# EAGLE schematic Schematic_NixieClock (EAGLE 9.7.0)
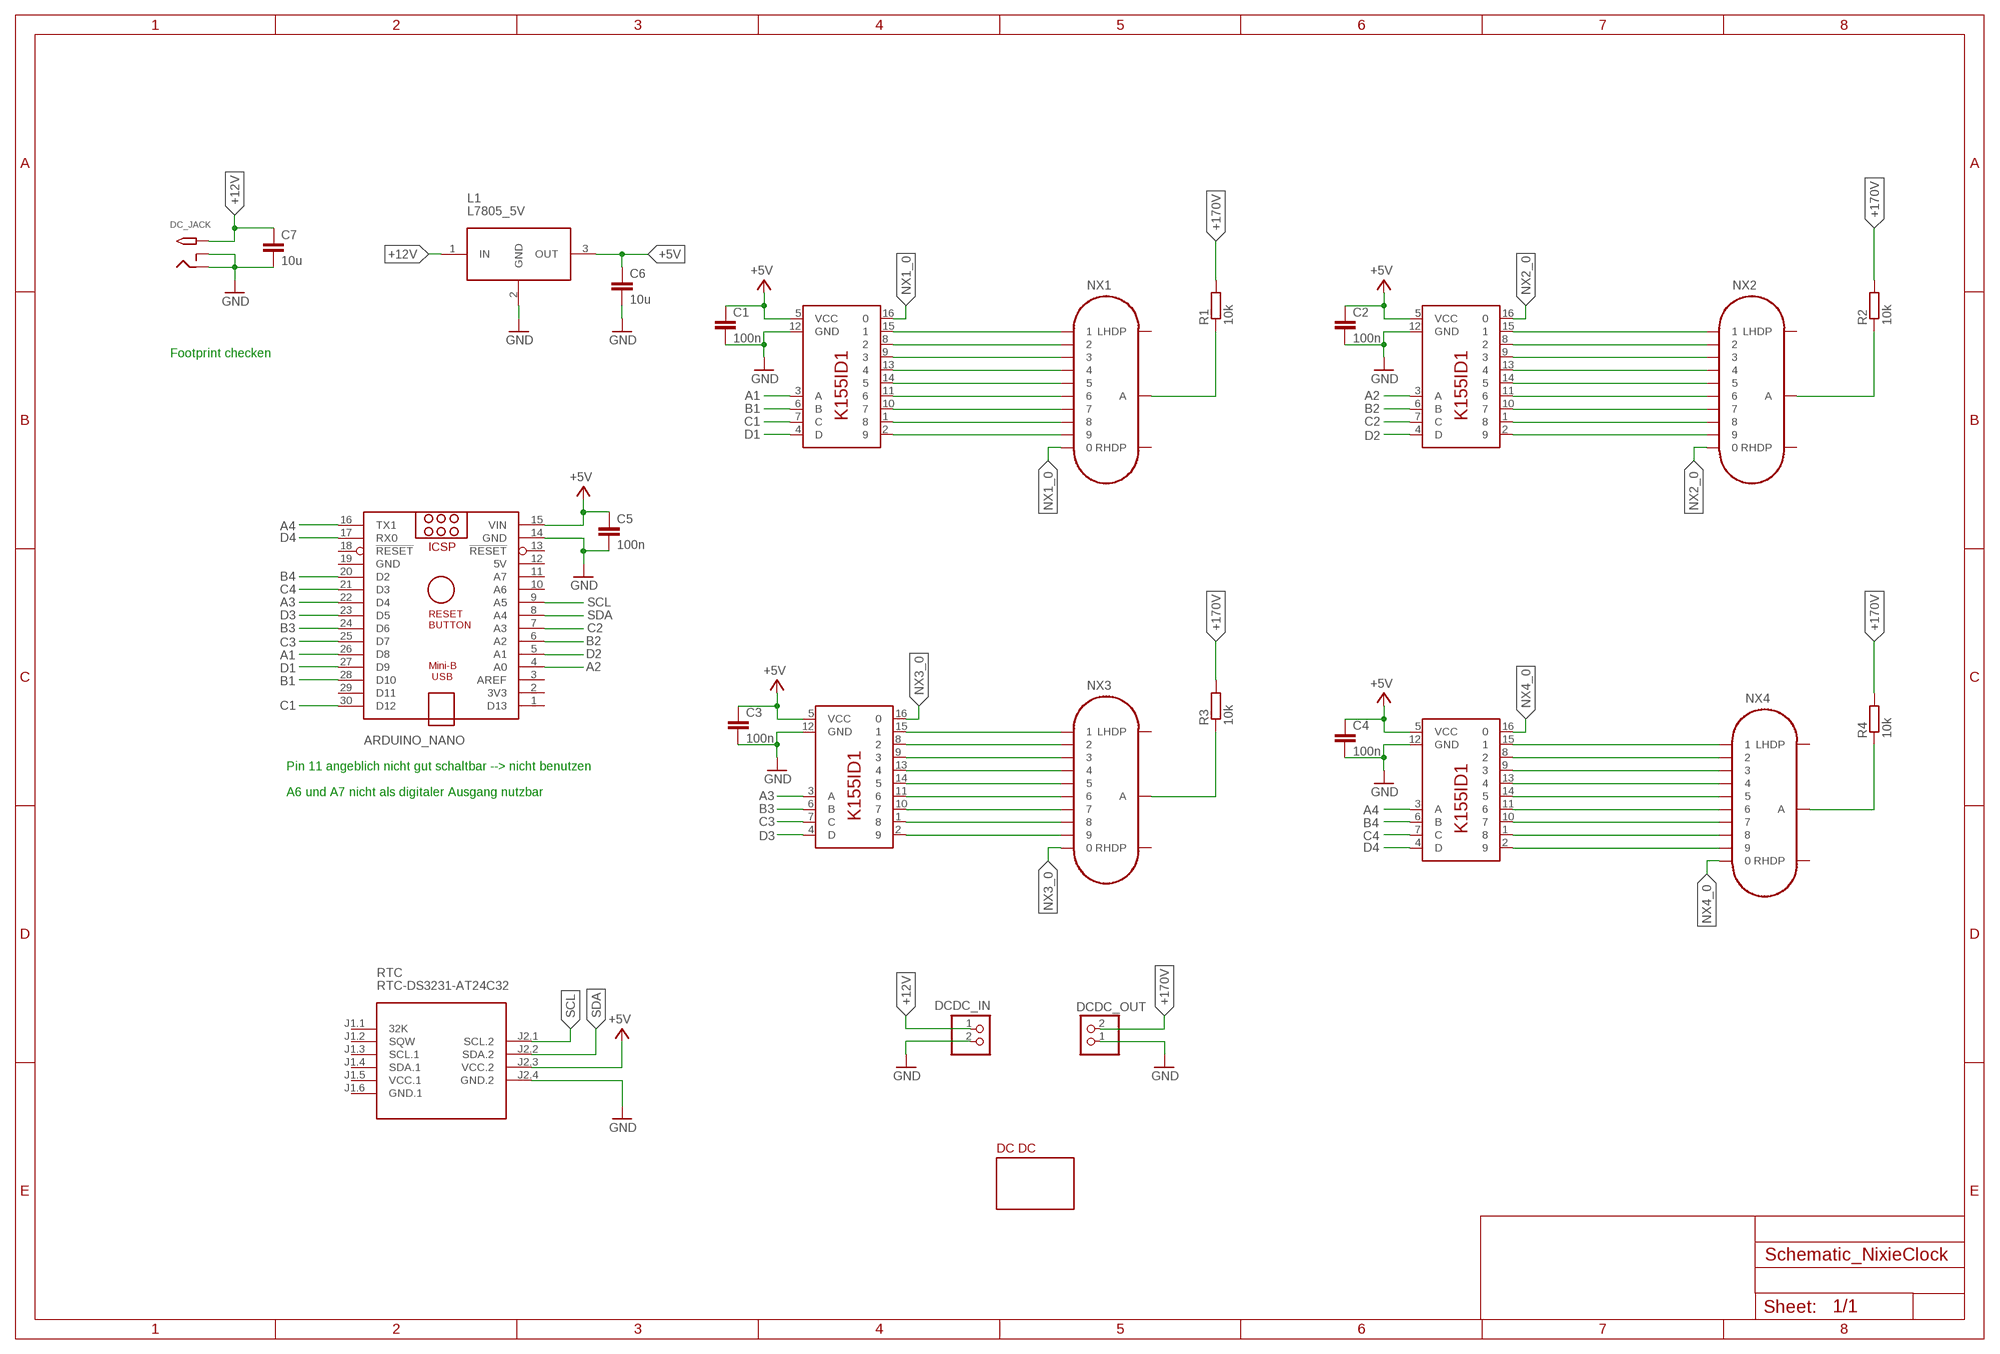
[diagram p0: schematic, sheet 1]

## Parts
ARDUINO_NANO  ARDUINO_NANO  [ARDUINO_NANO]
C1  100n  C-EUC0603  [C0603]
C2  100n  C-EUC0603  [C0603]
C3  100n  C-EUC0603  [C0603]
C4  100n  C-EUC0603  [C0603]
C5  100n  C-EUC0603  [C0603]
C6  10u  C-EUC0603  [C0603]
C7  10u  C-EUC0603  [C0603]
D1  DCDC_NIXIE  [NIXIE_DCDC]
DC_JACK  2.1MMJACKTHM  [PJ-102A]
DCDC_IN  PINHD-1X2  [1X02]
DCDC_OUT  PINHD-1X2  [1X02]
L1  L7805_5V  [TO220]
NX1  IN-14  [IN-14]
NX2  IN-14  [IN-14]
NX3  IN-14  [IN-14]
NX4  IN-14  [IN-14]
R1  10k  R-EU_R1206  [R1206]
R2  10k  R-EU_R1206  [R1206]
R3  10k  R-EU_R1206  [R1206]
R4  10k  R-EU_R1206  [R1206]
RTC  RTC-DS3231-AT24C32  [RTC-DS3231-AT24C32]
U1  K155ID1  [DIL16]
U2  K155ID1  [DIL16]
U3  K155ID1  [DIL16]
U4  K155ID1  [DIL16]

## Nets
+5V: ARDUINO_NANO.15(VIN) C1.1 C2.1 C3.1 C4.1 C5.1 C6.1 L1.3(OUT) RTC.J2.3(VCC.2) U1.5(VCC) U2.5(VCC) U3.5(VCC) U4.5(VCC)
+12V: C7.1 DC_JACK.TIP DCDC_IN.1 L1.1(IN)
+170V [HV]: DCDC_OUT.2 R1.2 R2.2 R3.2 R4.2
A1: ARDUINO_NANO.26(D8) U1.3(A)
A2: ARDUINO_NANO.4(A0) U3.3(A)
A3: ARDUINO_NANO.22(D4) U2.3(A)
A4: ARDUINO_NANO.16(TX1) U4.3(A)
B1: ARDUINO_NANO.28(D10) U1.6(B)
B2: ARDUINO_NANO.6(A2) U3.6(B)
B3: ARDUINO_NANO.24(D6) U2.6(B)
B4: ARDUINO_NANO.20(D2) U4.6(B)
C1: ARDUINO_NANO.30(D12) U1.7(C)
C2: ARDUINO_NANO.7(A3) U3.7(C)
C3: ARDUINO_NANO.25(D7) U2.7(C)
C4: ARDUINO_NANO.21(D3) U4.7(C)
D1: ARDUINO_NANO.27(D9) U1.4(D)
D2: ARDUINO_NANO.5(A1) U3.4(D)
D3: ARDUINO_NANO.23(D5) U2.4(D)
D4: ARDUINO_NANO.17(RX0) U4.4(D)
GND [GND]: ARDUINO_NANO.14(GND) C1.2 C2.2 C3.2 C4.2 C5.2 C6.2 C7.2 DC_JACK.RING DC_JACK.RING_SW DCDC_IN.2 DCDC_OUT.1 L1.2(GND) RTC.J2.4(GND.2) U1.12(GND) U2.12(GND) U3.12(GND) U4.12(GND)
N$1: NX1.1 U1.15
N$2: NX1.2 U1.8
N$3: NX1.3 U1.9
N$4: NX1.4 U1.13
N$5: NX1.5 U1.14
N$6: NX1.6 U1.11
N$7: NX1.7 U1.10
N$8: NX1.8 U1.1
N$9: NX1.9 U1.2
N$10: NX3.1 U2.15
N$11: NX3.2 U2.8
N$12: NX3.3 U2.9
N$13: NX3.4 U2.13
N$14: NX3.5 U2.14
N$15: NX3.6 U2.11
N$16: NX3.7 U2.10
N$17: NX3.8 U2.1
N$18: NX3.9 U2.2
N$19: NX2.1 U3.15
N$20: NX2.2 U3.8
N$21: NX2.3 U3.9
N$22: NX2.4 U3.13
N$23: NX2.5 U3.14
N$24: NX2.6 U3.11
N$25: NX2.7 U3.10
N$26: NX2.8 U3.1
N$27: NX2.9 U3.2
N$28: NX4.1 U4.15
N$29: NX4.2 U4.8
N$30: NX4.3 U4.9
N$31: NX4.4 U4.13
N$32: NX4.5 U4.14
N$33: NX4.6 U4.11
N$34: NX4.7 U4.10
N$35: NX4.8 U4.1
N$36: NX4.9 U4.2
N$37: NX3.A R3.1
N$38: NX1.A R1.1
N$39: NX2.A R2.1
N$40: NX4.A R4.1
NX1_0: NX1.0 U1.16
NX2_0: NX2.0 U3.16
NX3_0: NX3.0 U2.16
NX4_0: NX4.0 U4.16
SCL: ARDUINO_NANO.9(A5) RTC.J2.1(SCL.2)
SDA: ARDUINO_NANO.8(A4) RTC.J2.2(SDA.2)
Unconnected: ARDUINO_NANO.1(D13) ARDUINO_NANO.2(3V3) ARDUINO_NANO.3(AREF) ARDUINO_NANO.10(A6) ARDUINO_NANO.11(A7) ARDUINO_NANO.13(!RESET) ARDUINO_NANO.18(!RESET) ARDUINO_NANO.29(D11) NX1.LHDP NX1.RHDP NX2.LHDP NX2.RHDP NX3.LHDP NX3.RHDP NX4.LHDP NX4.RHDP RTC.J1.1(32K) RTC.J1.2(SQW) RTC.J1.3(SCL.1) RTC.J1.4(SDA.1)

## Notes on the sheet
- Footprint checken
- Pin 11 angeblich nicht gut schaltbar --> nicht benutzen
- A6 und A7 nicht als digitaler Ausgang nutzbar

## Power pins joined to a net without a drawn wire
5V: ARDUINO_NANO.12(5V)
GND: ARDUINO_NANO.19(GND)
GND.1: RTC.J1.6(GND.1)
VCC.1: RTC.J1.5(VCC.1)

## Library data of the parts
ARDUINO_NANO = ArduinoNanoV30:ARDUINO_NANO: Arduino Nano V3.0 Overview: The Arduino Nano is a small, complete, and breadboard-friendly board based on the ATmega328 (Arduino Nano 3.x) or ATmega168 (Arduino Nano 2.x). It has more or less the same functionality of the Arduino Duemilanove, but in a different package. It lacks only a DC power jack, and works with a Mini-B USB cable instead of a standard one. The Nano was designed and is being produced by Gravitech. Specifications: Microcontroller Atmel ATmega168 or ATmega328 Operating Voltage (logic level) 5 V Input Voltage (recommended) 7-12 V Input Voltage (limits) 6-20 V Digital I/O Pins 14 (of which 6 provide PWM output) Analog Input Pins 8 DC Current per I/O Pin 40 mA Flash Memory 16 KB (ATmega168) or 32 KB (ATmega328) of which 2 KB used by bootloader SRAM 1 KB (ATmega168) or 2 KB (ATmega328) EEPROM 512 bytes (ATmega168) or 1 KB (ATmega328) Clock Speed 16 MHz Dimensions 0.73" x 1.70" Length 45 mm Width 18 mm Weigth 5 g Power: The Arduino Nano can be powered via the Mini-B USB connection, 6-20V unregulated external power supply (pin 30), or 5V regulated external power supply (pin 27). The power source is automatically selected to the highest voltage source. Memory: The ATmega168 has 16 KB of flash memory for storing code (of which 2 KB is used for the bootloader); the ATmega328 has 32 KB, (also with 2 KB used for the bootloader). The ATmega168 has 1 KB of SRAM and 512 bytes of EEPROM (which can be read and written with the EEPROM library); the ATmega328 has 2 KB of SRAM and 1 KB of EEPROM. Input and Output: Each of the 14 digital pins on the Nano can be used as an input or output, using pinMode(), digitalWrite(), and digitalRead() functions. They operate at 5 volts. Each pin can provide or receive a maximum of 40 mA and has an internal pull-up resistor (disconnected by default) of 20-50 kOhms. In addition, some pins have specialized functions. Visit Arduino - ArduinoBoardNano <https://www.arduino.cc/en/Main/ArduinoBoardNano>
C1-C7 = rcl:C-EU: CAPACITOR, European symbol; SPICEPREFIX: C
D1 = Flo:DCDC_NIXIE
DC_JACK = adafruit:2.1MMJACK: 2.1mm x 5.5mm THM DC jack with internal switch. Digikey part #PJ-102A, 4UCON part #05537 2.1mm x 5.5mm SMT DC jack with internal switch. Digikey part #PJ-002A-SMT, 4UCON part #03267 By microbuilder.eu & adafruit.com
DCDC_IN DCDC_OUT = pinhead:PINHD-1X2: PIN HEADER
L1 = K155ID1:L7805_5V
NX1-NX4 = russian-nixies:IN-14: IN-14: medium numeric frontview nixie tube
R1-R4 = rcl:R-EU_: RESISTOR, European symbol; SPICEPREFIX: R
RTC = diy-modules:RTC-DS3231-AT24C32: RTC Module with Battery and EEPROM based on DS3231 and AT24C32 chips Tutorial can be found here: https://edwardmallon.wordpress.com/2014/05/21/using-a-cheap-3-ds3231-rtc-at24c32-eeprom-from-ebay/ Click here to find device on ebay.com <http://www.ebay.com/sch/DS3231+AT24C32+module>
U1-U4 = K155ID1:K155ID1

## Net classes
0 default: clearance 0.3 mm
1 HV: clearance 1 mm to class 0
2 GND: clearance 0.5 mm to class 0, clearance 1 mm to class 1